# EAGLE design GasSense (EAGLE 6.2)
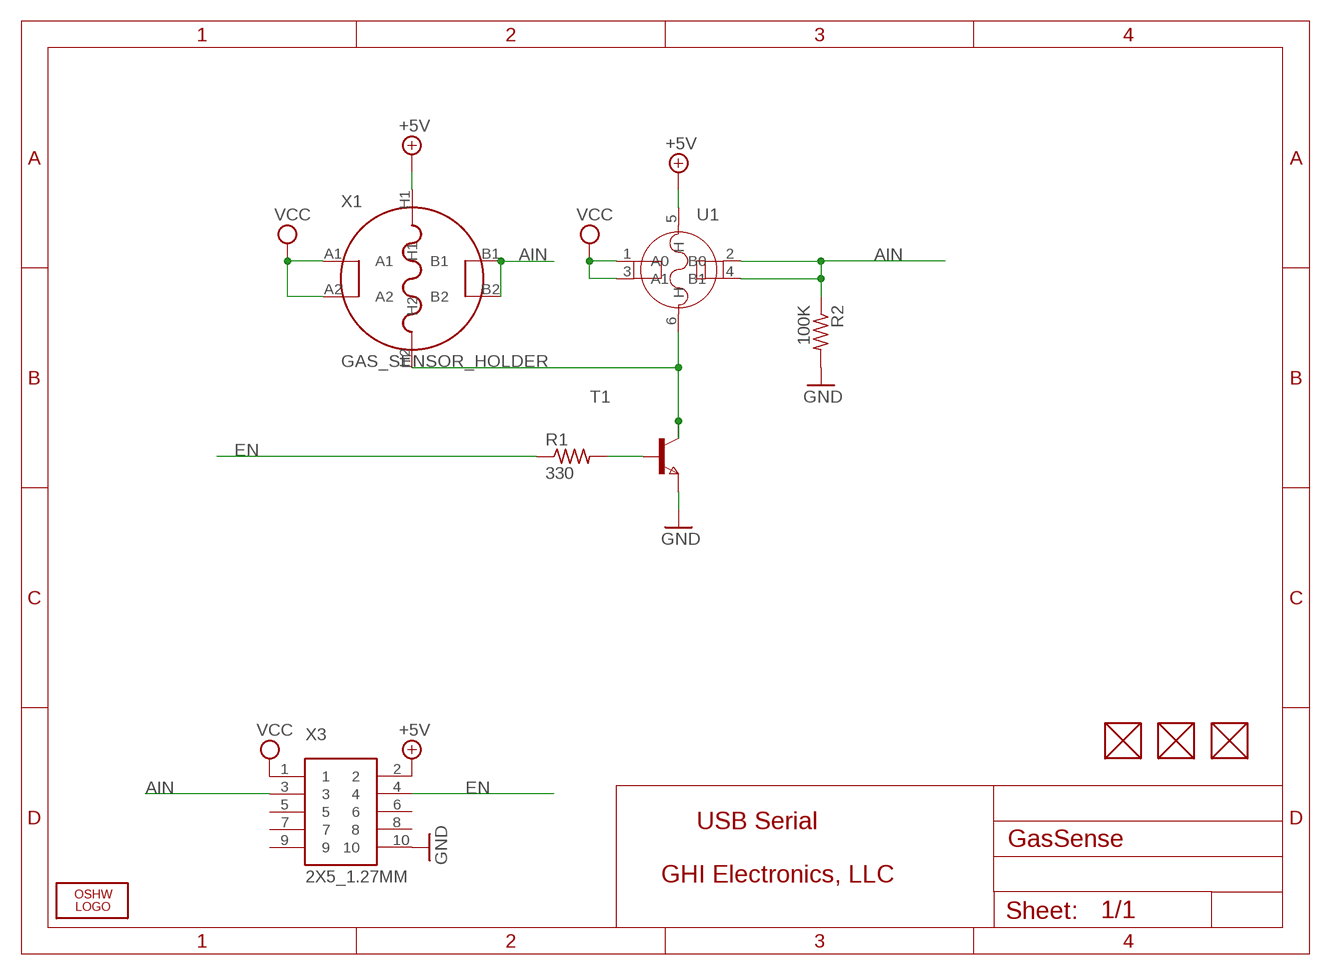
[diagram p0: schematic, sheet 1]

## Parts
FUD1  FIDUCIAL  [FIDUCIAL_40MIL]
FUD2  FIDUCIAL  [FIDUCIAL_40MIL]
FUD3  FIDUCIAL  [FIDUCIAL_40MIL]
LOGO1  LOGO-OSHW-FILLX0200-NT  [OSHW_FILLX200_NOTEXT]
R1  330  R-US_R0603  [R0603]
R2  100K  R-US_R0603  [R0603]
T1  NPNSOT223  [SOT223]
U1  SENSOR-MQ-5  [6P-LEADED-ROUND-D19]
X1  GAS_SENSOR_HOLDER  [GAS_SENSOR_HOLDER]
X3  2X5_1.27MM  [2X5_1.27MM]

## Nets
+5V [power]: U1.5(H) X1.H1 X3.2
AIN: R2.1 U1.2(B0) U1.4(B1) X1.B1 X1.B2 X3.3
EN: R1.1 X3.4
GND [power]: R2.2 T1.3(E) X3.10
N$2: R1.2 T1.1(B)
N$10: T1.2(C1) T1.4(C2) U1.6(H) X1.H2
VCC [power]: U1.1(A0) U1.3(A1) X1.A1 X1.A2 X3.1
Unconnected: FUD1.P$1 FUD2.P$1 FUD3.P$1 X3.5 X3.6 X3.7 X3.8 X3.9

## Notes on the sheet
- USB Serial
- GHI Electronics, LLC

## Library data of the parts
FUD1-FUD3 = GHI:FIDUCIAL
LOGO1 = Logo:LOGO-OSHW-FILL
R1 R2 = rcl:R-US_: RESISTOR, American symbol
T1 = zetex:NPNSOT223: NPN TRANSISTOR
U1 = Module:SENSOR-MQ-5
X1 = GHI:GAS_SENSOR_HOLDER
X3 = GHI:2X5_1.27MM

## Board
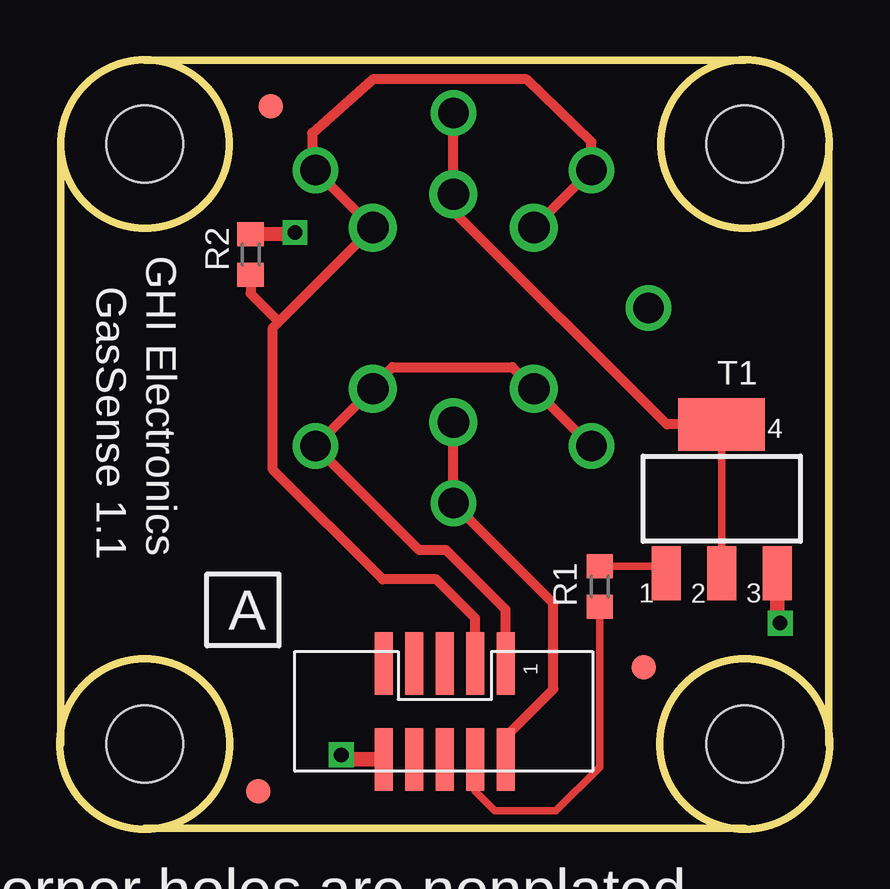
[diagram p1: board, top side]
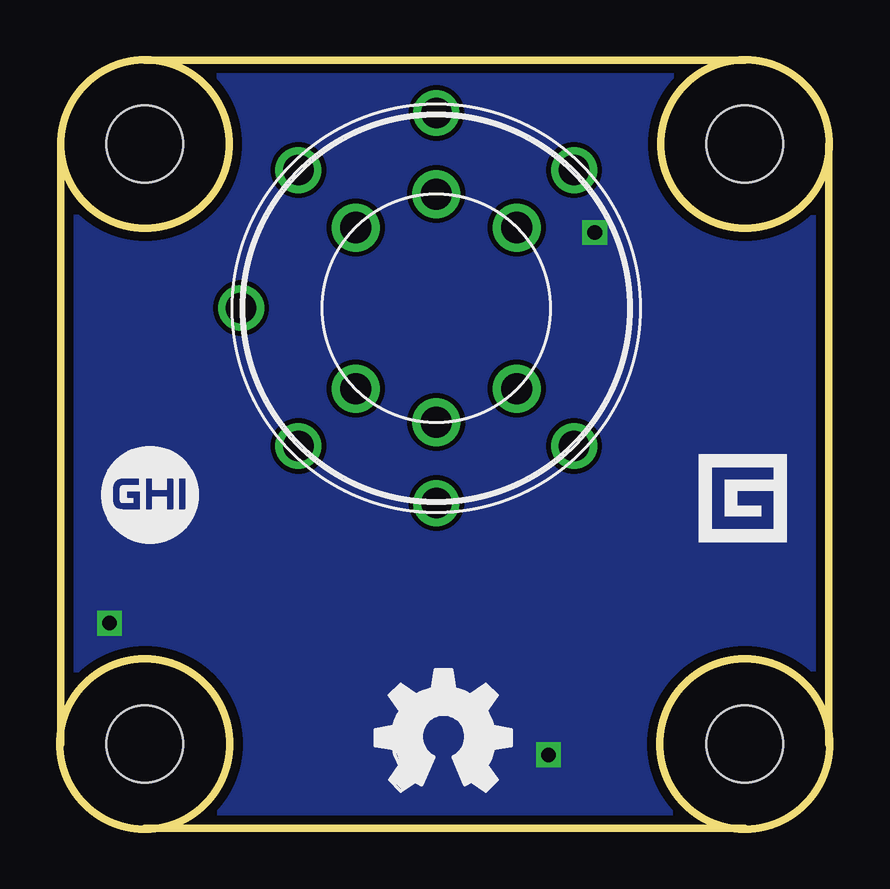
[diagram p2: board, bottom side, seen from below]

Size 32.07 x 32.04 mm. Coordinates in mm from the lower left corner, seen from the top.
Outline: 32.04,3.54 32.04,28.54
Outline: 0.04,28.54 0.04,3.54
Outline: 3.54,32.04 28.54,32.04
Outline: 28.54,0.04 3.54,0.04
Outline: circle at 3.54,28.54 radius 3.5
Outline: circle at 28.54,28.54 radius 3.5
Outline: circle at 28.54,3.54 radius 3.54
Outline: circle at 3.54,3.54 radius 3.54
Copper layers (1+16): Top 0.035mm / dielectric 1.5mm / Bottom 0.035mm
Design rules: minimum track width 8mil, minimum drill 12mil, track to track 8mil, track to pad 8mil, pad to pad 8mil, via to via 8mil, smd to smd 8mil, copper to edge 15mil, drill to drill 8mil, minimum pad ring 10mil, minimum via ring 7mil, stop-mask expansion 4mil, vias tented up to drill 50mil, thermal gap 10mil
Holes 3.2 mm at 3.54,3.54 28.54,28.54 3.54,28.54 28.54,3.54

### Footprints (pad centres in the part's own frame; a part is rotated, then mirrored left to right if it is on the bottom)
FIDUCIAL_40MIL = smd 1.016 x 1.016: P$1 0,0
R0603 = smd 1 x 1.1: 1 -0.85,0; 2 0.85,0
SOT223 = smd 1.219 x 2.235: 1 -2.311,-3.099; 2 0,-3.099; 3 2.311,-3.099 | smd 3.6 x 2.2: 4 0,3.099
6P-LEADED-ROUND-D19 = drill 1.3 pad 2: 1 -3.355,3.355; 2 -3.355,-3.355; 3 3.355,3.355; 4 3.355,-3.355; 5 0,4.75; 6 0,-4.75
GAS_SENSOR_HOLDER = drill 1.27: A1 -5.747,5.747; A2 -5.747,-5.747; B1 5.747,5.747; B2 5.747,-5.747; H1 -8.128,0; H2 8.128,0; NC 0,8.128
2X5_1.27MM = smd 2.6 x 0.74: 1 -2,2.58; 2 2,2.58; 3 -2,1.31; 4 2,1.31; 5 -2,0.04; 6 2,0.04; 7 -2,-1.23; 8 2,-1.23; 9 -2,-2.5; 10 2,-2.5

### Placement (x,y rotation side)
FUD1  8.27,1.56 0 top
FUD2  24.32,6.74 0 top
FUD3  8.77,30.11 0 top
LOGO1  18.93,1.56 0 bottom
R1  22.49,10.09 90 top
R2  7.94,23.93 90 top
T1  27.57,13.75 0 top
U1  16.39,21.7 180 bottom
X1  16.39,21.7 90 bottom
X3  15.99,4.9 270 top

### Tracks (layer width: path | path; a pad name or v marks a point on that pad's centre or on a via)
+5V
  Top 0.406: X3.2 18.57,3.84 20.56,5.83 20.56,9.4 X1.H1 U1.5
AIN
  Top 0.406: X3.3 17.3,8.78 15.68,10.4 13.45,10.4 8.87,14.97 8.87,20.89 9.12,21.13 | 9.12,21.13 U1.2 X1.B2 10.5,27.59 10.5,28.99 13.04,31.23 19.44,31.23 22.14,28.63 X1.B1 U1.4 | R2.1 7.94,22.31 9.12,21.13
EN
  Top 0.305: X3.4 17.3,1.57 18.12,0.75 20.66,0.75 22.49,2.58 R1.1
GND  (via drill 0.61)
  Top 0.61: X3.10 11.91,2.9 v11.72,3.08 | T1.3 29.88,8.65 v30.01,8.57 | R2.2 9.84,24.8 v9.79,24.85
  pour Bottom: 0.14,32.26 0.14,-0.27 31.94,-0.27 31.94,32.26
N$2
  Top 0.305: R1.2 24.97,10.94 T1.1
N$10
  Top 0.305: T1.4 T1.2
  Top 0.406: T1.4 25.28,16.85 16.49,25.64 16.49,26.35 U1.6 X1.H2
VCC
  Top 0.406: X3.1 18.57,9.14 16.09,11.62 14.98,11.62 X1.A2 U1.1 13.04,18.42 13.85,19.24 18.85,19.24 U1.3 X1.A1

### Text on the board
tPlace: GHI Electronics | GasSense 1.1 | A | corner holes are nonplated | black PCB with white text | Do not add manufacturing codes